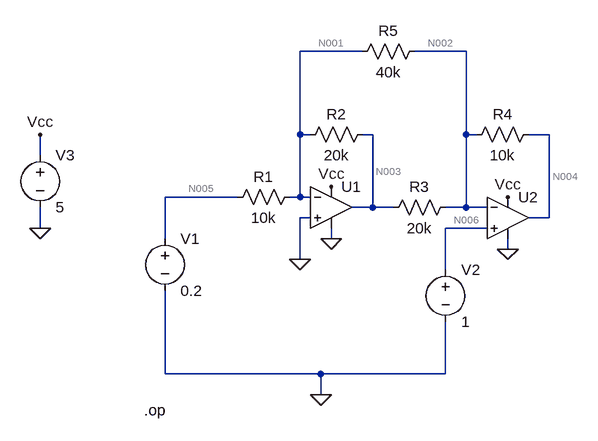
[diagram p0: schematic Draft2.asc]
Draft2.asc, the LTspice schematic file:
Version 4.1
SHEET 1 880 680
WIRE 192 -80 96 -80
WIRE 352 -80 272 -80
WIRE 96 48 96 -80
WIRE 112 48 96 48
WIRE 208 48 192 48
WIRE 352 48 352 -80
WIRE 368 48 352 48
WIRE 480 48 448 48
WIRE -304 80 -304 48
WIRE 0 144 -112 144
WIRE 96 144 96 48
WIRE 96 144 80 144
WIRE 112 144 96 144
WIRE 208 160 208 48
WIRE 208 160 176 160
WIRE 240 160 208 160
WIRE 352 160 352 48
WIRE 352 160 320 160
WIRE 384 160 352 160
WIRE 112 176 96 176
WIRE 480 176 480 48
WIRE 480 176 448 176
WIRE -304 192 -304 160
WIRE 384 192 320 192
WIRE -112 208 -112 144
WIRE 144 208 144 192
WIRE 416 224 416 208
WIRE 96 240 96 176
WIRE 320 256 320 192
WIRE -112 416 -112 288
WIRE 128 416 -112 416
WIRE 320 416 320 336
WIRE 320 416 128 416
WIRE 128 448 128 416
FLAG 144 208 0
FLAG 416 224 0
FLAG 96 240 0
FLAG 128 448 0
FLAG -304 48 Vcc
FLAG -304 192 0
FLAG 144 128 Vcc
FLAG 416 144 Vcc
DATAFLAG 352 -80 ""
DATAFLAG 480 176 ""
DATAFLAG 208 160 ""
DATAFLAG 96 -32 ""
DATAFLAG 352 48 ""
SYMBOL OpAmps\\UniversalOpAmp 144 160 R0
SYMATTR InstName U1
SYMBOL OpAmps\\UniversalOpAmp 416 176 R0
SYMATTR InstName U2
SYMBOL res 96 128 R90
WINDOW 0 0 56 VBottom 2
WINDOW 3 32 56 VTop 2
SYMATTR InstName R1
SYMATTR Value 10k
SYMBOL res 208 32 R90
WINDOW 0 0 56 VBottom 2
WINDOW 3 32 56 VTop 2
SYMATTR InstName R2
SYMATTR Value 20k
SYMBOL res 336 144 R90
WINDOW 0 0 56 VBottom 2
WINDOW 3 32 56 VTop 2
SYMATTR InstName R3
SYMATTR Value 20k
SYMBOL res 464 32 R90
WINDOW 0 0 56 VBottom 2
WINDOW 3 32 56 VTop 2
SYMATTR InstName R4
SYMATTR Value 10k
SYMBOL res 288 -96 R90
WINDOW 0 0 56 VBottom 2
WINDOW 3 32 56 VTop 2
SYMATTR InstName R5
SYMATTR Value 40k
SYMBOL voltage -112 192 R0
WINDOW 123 0 0 Left 0
WINDOW 39 0 0 Left 0
SYMATTR InstName V1
SYMATTR Value 0.2
SYMBOL voltage 320 240 R0
WINDOW 123 0 0 Left 0
WINDOW 39 0 0 Left 0
SYMATTR InstName V2
SYMATTR Value 1
SYMBOL voltage -304 64 R0
WINDOW 123 0 0 Left 0
WINDOW 39 0 0 Left 0
SYMATTR InstName V3
SYMATTR Value 5
TEXT -144 472 Left 2 !.op

The netlist it stands for:
* Draft2.asc
X§U1 0 N001 Vcc 0 N003 level1 Avol=1Meg GBW=10Meg Vos=0 En=0 Enk=0 In=0 Ink=0 Rin=500Meg  ; pins In+ In- V+ V- OUT
X§U2 N006 N002 Vcc 0 N004 level1 Avol=1Meg GBW=10Meg Vos=0 En=0 Enk=0 In=0 Ink=0 Rin=500Meg  ; pins In+ In- V+ V- OUT
R1 N001 N005 10k
R2 N003 N001 20k
R3 N002 N003 20k
R4 N004 N002 10k
R5 N002 N001 40k
V1 N005 0 0.2
V2 N006 0 1
V3 Vcc 0 5
.op
.lib UniversalOpAmp1.lib
.backanno
.end

* Results of the author's LTspice run, read from the files saved beside the schematic
* Operating Point:
*   V(n001) = 900.1 nV
*   V(n002) = 1 V
*   V(n003) = -900.1 mV
*   V(n004) = 2.2 V
*   V(n005) = 200 mV
*   V(n006) = 1 V
*   V(vcc) = 5 V
*   I(R1) = -20 µA
*   I(R2) = -45 µA
*   I(R3) = 95 µA
*   I(R4) = 120 µA
*   I(R5) = 25 µA
*   I(V1) = -20 µA
*   I(V2) = 3 nA
*   I(V3) = -18 nA
*   Ix(u1:1) = -5 nA
*   Ix(u1:2) = -5 nA
*   Ix(u1:3) = 10 nA
*   Ix(u1:4) = 0 A
*   Ix(u1:5) = 140 µA
*   Ix(u2:1) = -3 nA
*   Ix(u2:2) = -3 nA
*   Ix(u2:3) = 8 nA
*   Ix(u2:4) = -2 nA
*   Ix(u2:5) = -120 µA